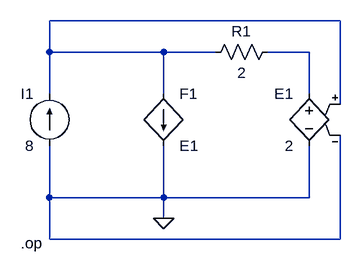
[diagram p0: schematic VCVS_and_CCCS.asc]
VCVS_and_CCCS.asc, the LTspice schematic file:
Version 4
SHEET 1 880 680
WIRE 464 16 16 16
WIRE 16 64 16 16
WIRE 192 64 16 64
WIRE 272 64 192 64
WIRE 416 64 352 64
WIRE 16 128 16 64
WIRE 192 128 192 64
WIRE 416 128 416 64
WIRE 464 144 464 16
WIRE 16 288 16 208
WIRE 192 288 192 208
WIRE 192 288 16 288
WIRE 416 288 416 208
WIRE 416 288 192 288
WIRE 192 320 192 288
WIRE 16 352 16 288
WIRE 464 352 464 192
WIRE 464 352 16 352
FLAG 192 320 0
SYMBOL f 192 128 R0
SYMATTR InstName F1
SYMATTR Value E1
SYMATTR Value2 3
SYMBOL e 416 112 M0
SYMATTR InstName E1
SYMATTR Value 2
SYMBOL res 368 48 R90
WINDOW 0 0 56 VBottom 2
WINDOW 3 32 56 VTop 2
SYMATTR InstName R1
SYMATTR Value 2
SYMBOL current 16 208 R180
WINDOW 0 24 80 Left 2
WINDOW 3 24 0 Left 2
WINDOW 123 0 0 Left 0
WINDOW 39 0 0 Left 0
SYMATTR InstName I1
SYMATTR Value 8
TEXT -28 358 Left 2 !.op

The netlist it stands for:
* VCVS_and_CCCS.asc
F1 N001 0 E1 3
E1 N002 0 N001 0 2
R1 N002 N001 2
I1 0 N001 8
.op
.backanno
.end